# Altium schematic sheet FPGA.SchDoc
size A0; SheetNumber: 8; SheetTotal: 12
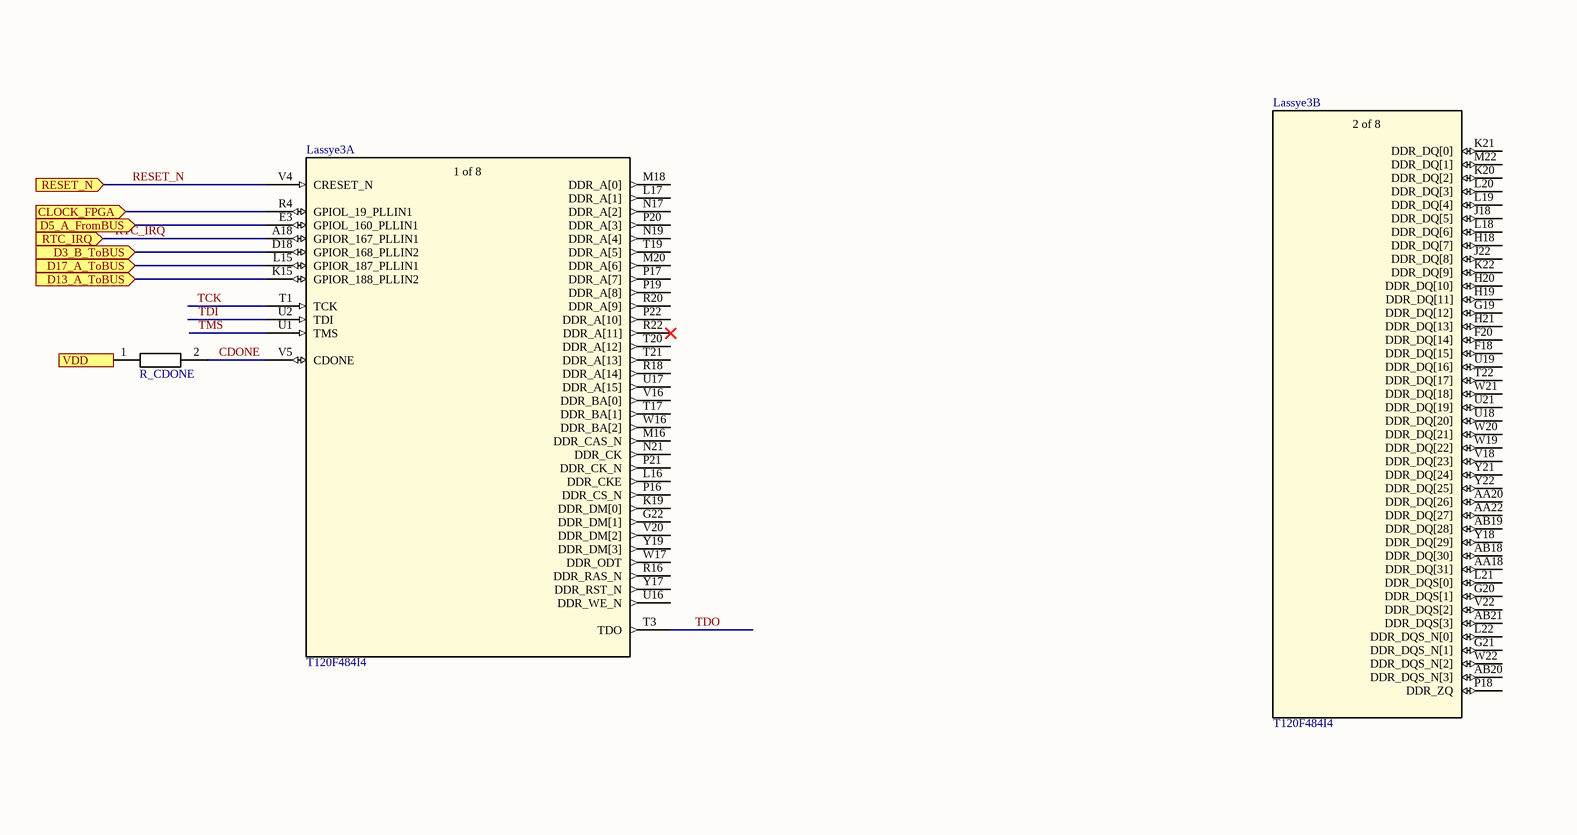
[diagram p0: FPGA.SchDoc, top left]
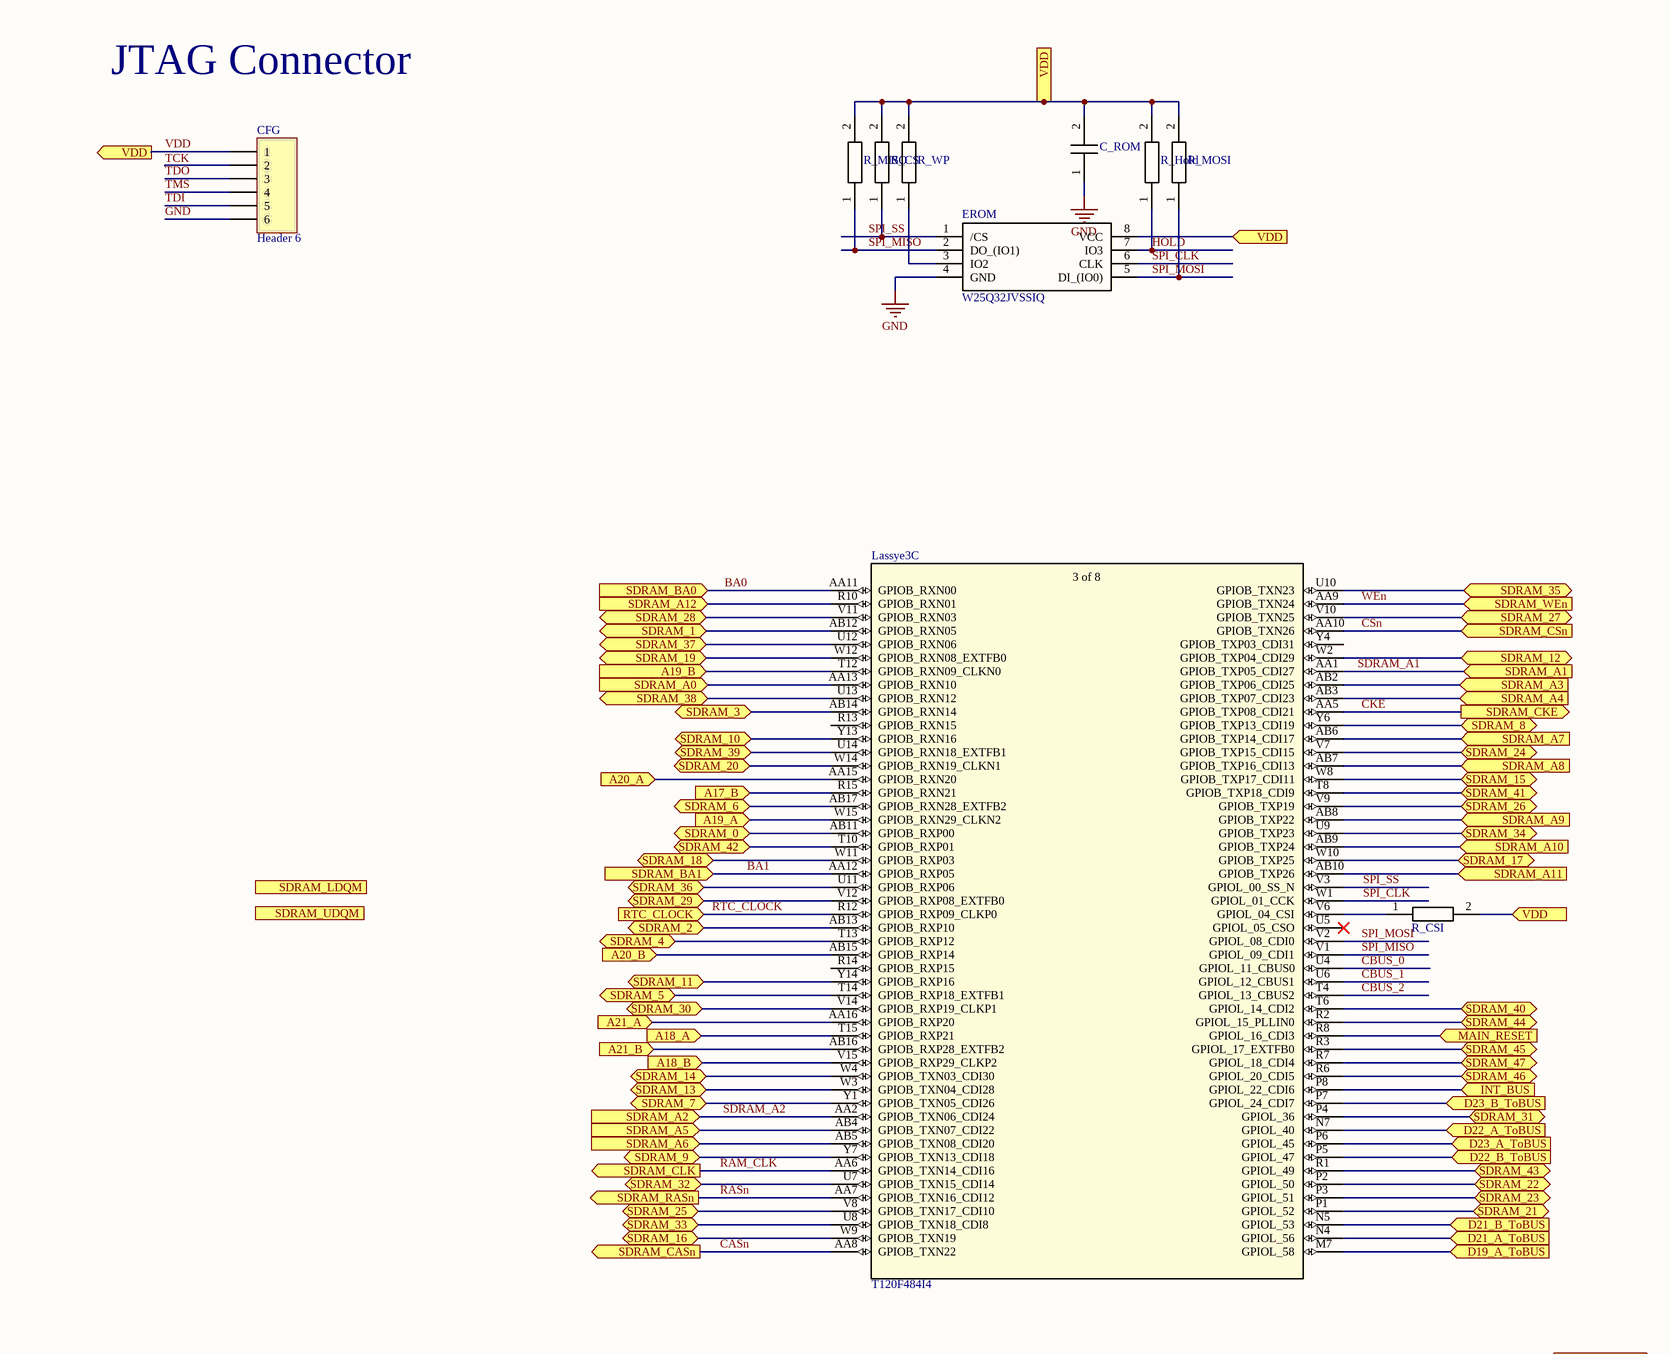
[diagram p1: FPGA.SchDoc, top middle]
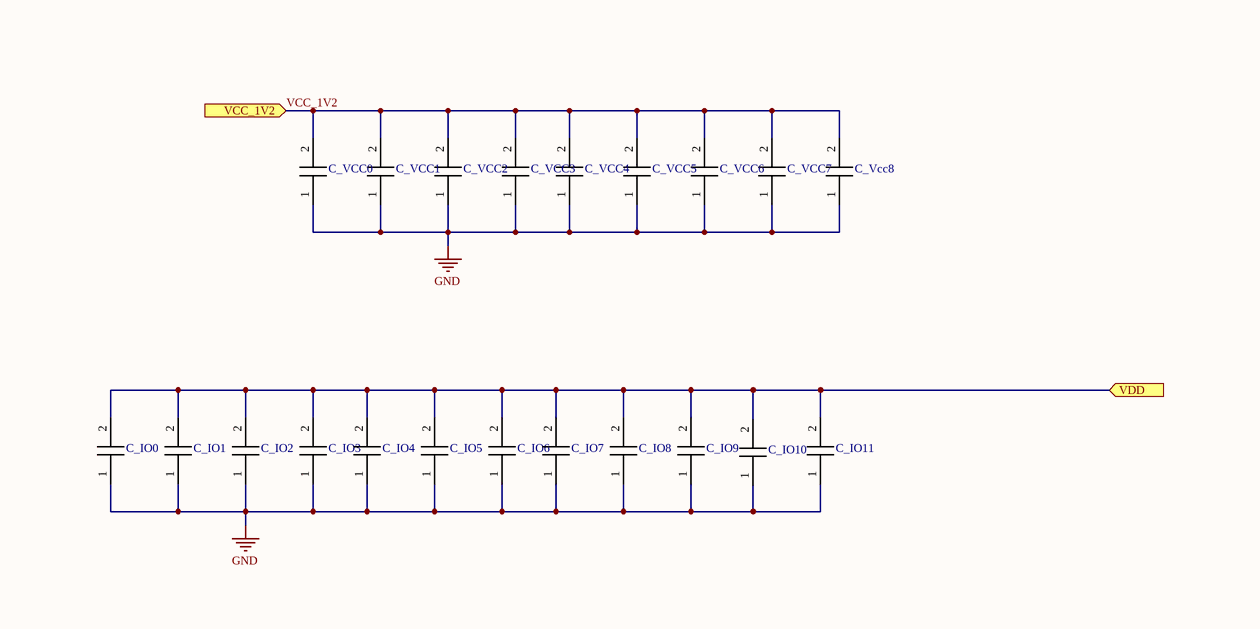
[diagram p2: FPGA.SchDoc, top right]
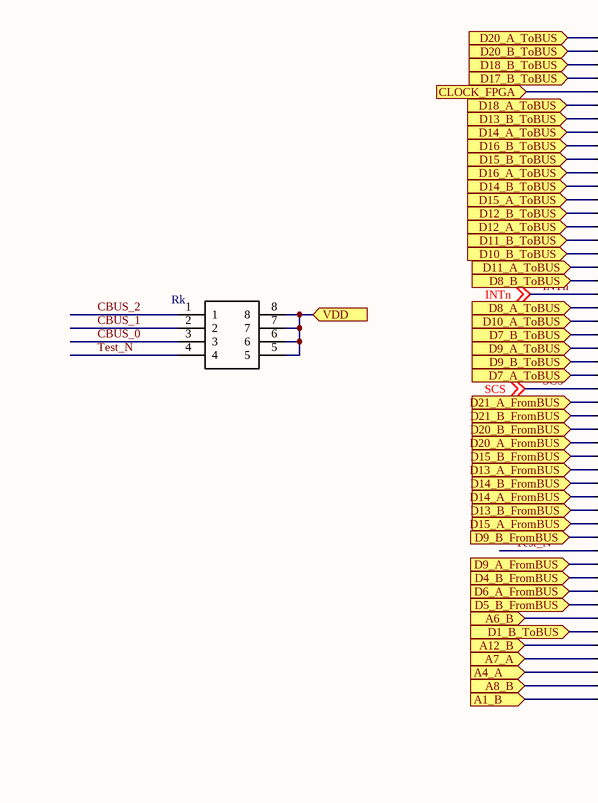
[diagram p3: FPGA.SchDoc, bottom middle]
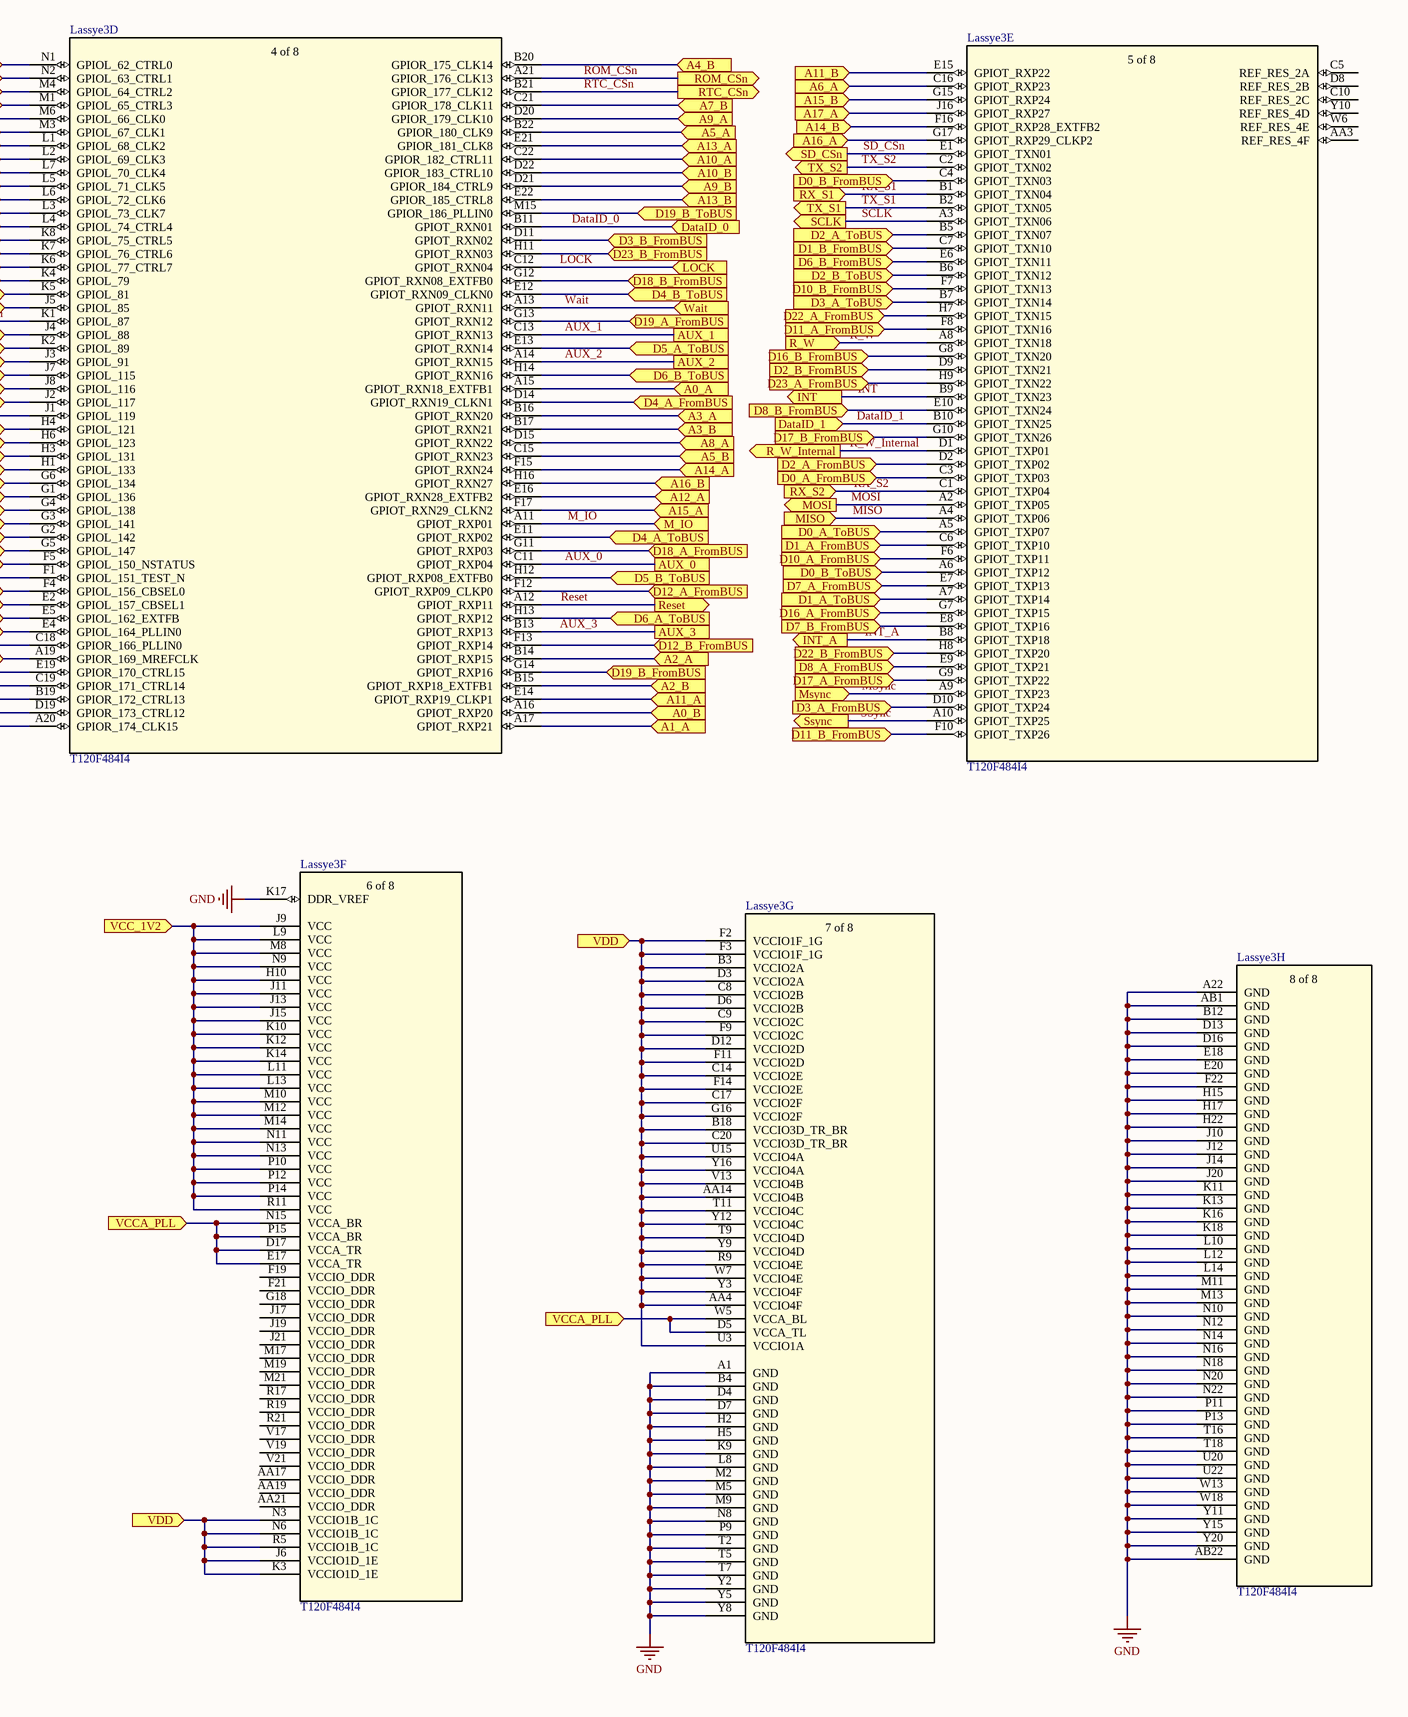
[diagram p4: FPGA.SchDoc, bottom right]

## Parts
C_IO0  GRM155R71C104JA88J  [CAPC1005X55N]  (value not drawn)
C_IO1  GRM155R71C104JA88J  [CAPC1005X55N]  (value not drawn)
C_IO2  GRM155R71C104JA88J  [CAPC1005X55N]  (value not drawn)
C_IO3  GRM155R71C104JA88J  [CAPC1005X55N]  (value not drawn)
C_IO4  GRM155R71C104JA88J  [CAPC1005X55N]  (value not drawn)
C_IO5  GRM155R71C104JA88J  [CAPC1005X55N]  (value not drawn)
C_IO6  GRM155R71C104JA88J  [CAPC1005X55N]  (value not drawn)
C_IO7  GRM155R71C104JA88J  [CAPC1005X55N]  (value not drawn)
C_IO8  GRM155R71C104JA88J  [CAPC1005X55N]  (value not drawn)
C_IO9  GRM155R71C104JA88J  [CAPC1005X55N]  (value not drawn)
C_IO10  GRM155R71C104JA88J  [CAPC1005X55N]  (value not drawn)
C_IO11  GRM155R71C104JA88J  [CAPC1005X55N]  (value not drawn)
C_ROM  0603YC104K4T2A  [CAPC1608X90N]  (value not drawn)
C_VCC0  GRM155R71C104JA88J  [CAPC1005X55N]  (value not drawn)
C_VCC1  GRM155R71C104JA88J  [CAPC1005X55N]  (value not drawn)
C_VCC2  GRM155R71C104JA88J  [CAPC1005X55N]  (value not drawn)
C_VCC3  GRM155R71C104JA88J  [CAPC1005X55N]  (value not drawn)
C_VCC4  GRM155R71C104JA88J  [CAPC1005X55N]  (value not drawn)
C_VCC5  GRM155R71C104JA88J  [CAPC1005X55N]  (value not drawn)
C_VCC6  GRM155R71C104JA88J  [CAPC1005X55N]  (value not drawn)
C_VCC7  GRM155R71C104JA88J  [CAPC1005X55N]  (value not drawn)
C_Vcc8  GRM155R71C104JA88J  [CAPC1005X55N]  (value not drawn)
CFG  Header 6  [HDR1X6]
EROM  W25Q32JVSSIQ  [SOIC127P790X216-8N]
Lassye3  T120F484I4  [FBGA484_TRION_EFI]  (parts A,B,C,D,E,F,G,H of 8)
R_CDONE  CRCW060310K0FKEB  [RESC1608X50N]  (value not drawn)
R_CS  CRCW060310K0FKEB  [RESC1608X50N]  (value not drawn)
R_CSI  CRCW060310K0FKEB  [RESC1608X50N]  (value not drawn)
R_Hold  CRCW060310K0FKEB  [RESC1608X50N]  (value not drawn)
R_MISO  CRCW060310K0FKEB  [RESC1608X50N]  (value not drawn)
R_MOSI  CRCW060310K0FKEB  [RESC1608X50N]  (value not drawn)
R_WP  CRCW060310K0FKEB  [RESC1608X50N]  (value not drawn)
Rk  CAT16A-1002F4LF  [CAT16A1002F4LF]  (value not drawn)

## Ports
A0_A (in), A0_B (in), A1_A (in), A1_B (in), A2_A (in), A2_B (in), A3_A (in), A3_B (in), A4_A (in), A4_B (in), A5_A (in), A5_B (in), A6_A (in), A6_B (in), A7_A (in), A7_B (in), A8_A (in), A8_B (in), A9_A (in), A9_B (in), A10_A (in), A10_B (in), A11_A (in), A11_B (in), A12_A (in), A12_B (in), A13_A (in), A13_B (in), A14_A (in), A14_B (in), A15_A (in), A15_B (in), A16_A (in), A16_B (in), A17_A (in), A17_B (in), A18_A (in), A18_B (in), A19_A (in), A19_B (in), A20_A (in), A20_B (in), A21_A (in), A21_B (in), AUX_0, AUX_1, AUX_2, AUX_3, CLOCK_FPGA (in), D0_A_FromBUS (in), D0_A_ToBUS (in), D0_B_FromBUS (in), D0_B_ToBUS (in), D1_A_FromBUS (in), D1_A_ToBUS (in), D1_B_FromBUS (in), D1_B_ToBUS (in), D2_A_FromBUS (in), D2_A_ToBUS (in), D2_B_FromBUS (in), D2_B_ToBUS (in), D3_A_FromBUS (in), D3_A_ToBUS (in), D3_B_FromBUS (in), D3_B_ToBUS (in), D4_A_FromBUS (in), D4_A_ToBUS (in), D4_B_FromBUS (in), D4_B_ToBUS (in), D5_A_FromBUS (in), D5_A_ToBUS (in), D5_B_FromBUS (in), D5_B_ToBUS (in), D6_A_FromBUS (in), D6_A_ToBUS (in), D6_B_FromBUS (in), D6_B_ToBUS (in), D7_A_FromBUS (in), D7_A_ToBUS (in), D7_B_FromBUS (in), D7_B_ToBUS (in), D8_A_FromBUS (in), D8_A_ToBUS (in), D8_B_FromBUS (in), D8_B_ToBUS (in), D9_A_FromBUS (in), D9_A_ToBUS (in), D9_B_FromBUS (in), D9_B_ToBUS (in), D10_A_FromBUS (in), D10_A_ToBUS (in), D10_B_FromBUS (in), D10_B_ToBUS (in), D11_A_FromBUS (in), D11_A_ToBUS (in), D11_B_FromBUS (in), D11_B_ToBUS (in), D12_A_FromBUS (in), D12_A_ToBUS (in), D12_B_FromBUS (in), D12_B_ToBUS (in), D13_A_FromBUS (in), D13_A_ToBUS (in), D13_B_FromBUS (in), D13_B_ToBUS (in), D14_A_FromBUS (in), D14_A_ToBUS (in), D14_B_FromBUS (in), D14_B_ToBUS (in), D15_A_FromBUS (in), D15_A_ToBUS (in), D15_B_FromBUS (in), D15_B_ToBUS (in), D16_A_FromBUS (in), D16_A_ToBUS (in), D16_B_FromBUS (in), D16_B_ToBUS (in), D17_A_FromBUS (in), D17_A_ToBUS (in), D17_B_FromBUS (in), D17_B_ToBUS (in), D18_A_FromBUS (in), D18_A_ToBUS (in), D18_B_FromBUS (in), D18_B_ToBUS (in), D19_A_FromBUS (in), D19_A_ToBUS (in), D19_B_FromBUS (in), D19_B_ToBUS (in), D20_A_FromBUS (in), D20_A_ToBUS (in), D20_B_FromBUS (in), D20_B_ToBUS (in), D21_A_FromBUS (in), D21_A_ToBUS (in), D21_B_FromBUS (in), D21_B_ToBUS (in), D22_A_FromBUS (in), D22_A_ToBUS (in), D22_B_FromBUS (in), D22_B_ToBUS (in), D23_A_FromBUS (in), D23_A_ToBUS (in), D23_B_FromBUS (in), D23_B_ToBUS (in), DataID_0 (in), DataID_1 (in), INT (out), INT_A (out), INT_BUS (in), LOCK (in), M_IO (in), MAIN_RESET (in), MISO (in), MOSI (out), Msync (in), R_W (in), R_W_Internal (out), Reset (out), RESET_N (in), ROM_CSn (out), RTC_CLOCK (in), RTC_CSn (out), RTC_IRQ (in), RX_S1 (in), RX_S2 (in), SCLK (out), SD_CSn (out), SDRAM_0 (bidir), SDRAM_1 (bidir), SDRAM_2 (bidir), SDRAM_3 (bidir), SDRAM_4 (bidir), SDRAM_5 (bidir), SDRAM_6 (bidir), SDRAM_7 (bidir), SDRAM_8 (bidir), SDRAM_9 (bidir), SDRAM_10 (bidir), SDRAM_11 (bidir), SDRAM_12 (bidir), SDRAM_13 (bidir), SDRAM_14 (bidir), SDRAM_15 (bidir), SDRAM_16 (bidir), SDRAM_17 (bidir), SDRAM_18 (bidir), SDRAM_19 (bidir), SDRAM_20 (bidir), SDRAM_21 (bidir), SDRAM_22 (bidir), SDRAM_23 (bidir), SDRAM_24 (bidir), SDRAM_25 (bidir), SDRAM_26 (bidir), SDRAM_27 (bidir), SDRAM_28 (bidir), SDRAM_29 (bidir), SDRAM_30 (bidir), SDRAM_31 (bidir), SDRAM_32 (bidir), SDRAM_33 (bidir), SDRAM_34 (bidir), SDRAM_35 (bidir), SDRAM_36 (bidir), SDRAM_37 (bidir), SDRAM_38 (bidir), SDRAM_39 (bidir), SDRAM_40 (bidir), SDRAM_41 (bidir), SDRAM_42 (bidir), SDRAM_43 (bidir), SDRAM_44 (bidir), SDRAM_45 (bidir), SDRAM_46 (bidir), SDRAM_47 (bidir), SDRAM_A0 (in), SDRAM_A1 (in), SDRAM_A2 (in), SDRAM_A3 (in), SDRAM_A4 (in), SDRAM_A5 (in), SDRAM_A6 (in), SDRAM_A7 (in), SDRAM_A8 (in), SDRAM_A9 (in), SDRAM_A10 (in), SDRAM_A11 (in), SDRAM_A12 (in), SDRAM_BA0 (in), SDRAM_BA1 (in), SDRAM_CASn (out), SDRAM_CKE (out), SDRAM_CLK (out), SDRAM_CSn (in), SDRAM_LDQM (out), SDRAM_RASn (out), SDRAM_UDQM (out), SDRAM_WEn (in), Ssync (out), TX_S1 (out), TX_S2 (out), VCC_1V2 (in), VCCA_PLL (in), VDD (in), VDD (out), Wait (in)

## Nets
GND: C_IO0.1 C_IO1.1 C_IO2.1 C_IO3.1 C_IO4.1 C_IO5.1 C_IO6.1 C_IO7.1 C_IO8.1 C_IO9.1 C_IO10.1 C_IO11.1 C_ROM.1 C_VCC0.1 C_VCC1.1 C_VCC2.1 C_VCC3.1 C_VCC4.1 C_VCC5.1 C_VCC6.1 C_VCC7.1 C_Vcc8.1 CFG.6 EROM.4(GND) Lassye3.A1(GND) Lassye3.A22(GND) Lassye3.AB1(GND) Lassye3.AB22(GND) Lassye3.B4(GND) Lassye3.B12(GND) Lassye3.D4(GND) Lassye3.D7(GND) Lassye3.D13(GND) Lassye3.D16(GND) Lassye3.E18(GND) Lassye3.E20(GND) Lassye3.F22(GND) Lassye3.H2(GND) Lassye3.H5(GND) Lassye3.H15(GND) Lassye3.H17(GND) Lassye3.H22(GND) Lassye3.J10(GND) Lassye3.J12(GND) Lassye3.J14(GND) Lassye3.J20(GND) Lassye3.K9(GND) Lassye3.K11(GND) Lassye3.K13(GND) Lassye3.K16(GND) Lassye3.K17(DDR_VREF) Lassye3.K18(GND) Lassye3.L8(GND) Lassye3.L10(GND) Lassye3.L12(GND) Lassye3.L14(GND) Lassye3.M2(GND) Lassye3.M5(GND) Lassye3.M9(GND) Lassye3.M11(GND) Lassye3.M13(GND) Lassye3.N8(GND) Lassye3.N10(GND) Lassye3.N12(GND) Lassye3.N14(GND) Lassye3.N16(GND) Lassye3.N18(GND) Lassye3.N20(GND) Lassye3.N22(GND) Lassye3.P9(GND) Lassye3.P11(GND) Lassye3.P13(GND) Lassye3.T2(GND) Lassye3.T5(GND) Lassye3.T7(GND) Lassye3.T16(GND) Lassye3.T18(GND) Lassye3.U20(GND) Lassye3.U22(GND) Lassye3.W13(GND) Lassye3.W18(GND) Lassye3.Y2(GND) Lassye3.Y5(GND) Lassye3.Y8(GND) Lassye3.Y11(GND) Lassye3.Y15(GND) Lassye3.Y20(GND)
A0_A: Lassye3.A15(GPIOT_RXN18_EXTFB1) ; port A0_A
A0_B: Lassye3.A16(GPIOT_RXP20) ; port A0_B
A1_A: Lassye3.A17(GPIOT_RXP21) ; port A1_A
A1_B: Lassye3.A20(GPIOR_174_CLK15) ; port A1_B
A2_A: Lassye3.B14(GPIOT_RXP15) ; port A2_A
A2_B: Lassye3.B15(GPIOT_RXP18_EXTFB1) ; port A2_B
A3_A: Lassye3.B16(GPIOT_RXN20) ; port A3_A
A3_B: Lassye3.B17(GPIOT_RXN21) ; port A3_B
A4_A: Lassye3.B19(GPIOR_172_CTRL13) ; port A4_A
A4_B: Lassye3.B20(GPIOR_175_CLK14) ; port A4_B
A5_A: Lassye3.B22(GPIOR_180_CLK9) ; port A5_A
A5_B: Lassye3.C15(GPIOT_RXN23) ; port A5_B
A6_A: Lassye3.C16(GPIOT_RXP23) ; port A6_A
A6_B: Lassye3.C18(GPIOR_166_PLLIN0) ; port A6_B
A7_A: Lassye3.C19(GPIOR_171_CTRL14) ; port A7_A
A7_B: Lassye3.C21(GPIOR_178_CLK11) ; port A7_B
A8_A: Lassye3.D15(GPIOT_RXN22) ; port A8_A
A8_B: Lassye3.D19(GPIOR_173_CTRL12) ; port A8_B
A9_A: Lassye3.D20(GPIOR_179_CLK10) ; port A9_A
A9_B: Lassye3.D21(GPIOR_184_CTRL9) ; port A9_B
A10_A: Lassye3.C22(GPIOR_182_CTRL11) ; port A10_A
A10_B: Lassye3.D22(GPIOR_183_CTRL10) ; port A10_B
A11_A: Lassye3.E14(GPIOT_RXP19_CLKP1) ; port A11_A
A11_B: Lassye3.E15(GPIOT_RXP22) ; port A11_B
A12_A: Lassye3.E16(GPIOT_RXN28_EXTFB2) ; port A12_A
A12_B: Lassye3.E19(GPIOR_170_CTRL15) ; port A12_B
A13_A: Lassye3.E21(GPIOR_181_CLK8) ; port A13_A
A13_B: Lassye3.E22(GPIOR_185_CTRL8) ; port A13_B
A14_A: Lassye3.F15(GPIOT_RXN24) ; port A14_A
A14_B: Lassye3.F16(GPIOT_RXP28_EXTFB2) ; port A14_B
A15_A: Lassye3.F17(GPIOT_RXN29_CLKN2) ; port A15_A
A15_B: Lassye3.G15(GPIOT_RXP24) ; port A15_B
A16_A: Lassye3.G17(GPIOT_RXP29_CLKP2) ; port A16_A
A16_B: Lassye3.H16(GPIOT_RXN27) ; port A16_B
A17_A: Lassye3.J16(GPIOT_RXP27) ; port A17_A
A17_B: Lassye3.R15(GPIOB_RXN21) ; port A17_B
A18_A: Lassye3.T15(GPIOB_RXP21) ; port A18_A
A18_B: Lassye3.V15(GPIOB_RXP29_CLKP2) ; port A18_B
A19_A: Lassye3.W15(GPIOB_RXN29_CLKN2) ; port A19_A
A19_B: Lassye3.T12(GPIOB_RXN09_CLKN0) ; port A19_B
A20_A: Lassye3.AA15(GPIOB_RXN20) ; port A20_A
A20_B: Lassye3.AB15(GPIOB_RXP14) ; port A20_B
A21_A: Lassye3.AA16(GPIOB_RXP20) ; port A21_A
A21_B: Lassye3.AB16(GPIOB_RXP28_EXTFB2) ; port A21_B
AUX_0: Lassye3.C11(GPIOT_RXP04) ; port AUX_0
AUX_1: Lassye3.C13(GPIOT_RXN13) ; port AUX_1
AUX_2: Lassye3.A14(GPIOT_RXN15) ; port AUX_2
AUX_3: Lassye3.B13(GPIOT_RXP13) ; port AUX_3
BA0: Lassye3.AA11(GPIOB_RXN00) ; port SDRAM_BA0
BA1: Lassye3.AA12(GPIOB_RXP05) ; port SDRAM_BA1
CASn: Lassye3.AA8(GPIOB_TXN22) ; port SDRAM_CASn
CBUS_0: Lassye3.U4(GPIOL_11_CBUS0) Rk.3
CBUS_1: Lassye3.U6(GPIOL_12_CBUS1) Rk.2
CBUS_2: Lassye3.T4(GPIOL_13_CBUS2) Rk.1
CDONE: Lassye3.V5(CDONE) R_CDONE.2
CKE: Lassye3.AA5(GPIOB_TXP08_CDI21) ; port SDRAM_CKE
CLOCK_FPGA: Lassye3.M6(GPIOL_66_CLK0) Lassye3.R4(GPIOL_19_PLLIN1) ; port CLOCK_FPGA
CSn: Lassye3.AA10(GPIOB_TXN26) ; port SDRAM_CSn
D0_A_FromBUS: Lassye3.C3(GPIOT_TXP03) ; port D0_A_FromBUS
D0_A_ToBUS: Lassye3.A5(GPIOT_TXP07) ; port D0_A_ToBUS
D0_B_FromBUS: Lassye3.C4(GPIOT_TXN03) ; port D0_B_FromBUS
D0_B_ToBUS: Lassye3.A6(GPIOT_TXP12) ; port D0_B_ToBUS
D1_A_FromBUS: Lassye3.C6(GPIOT_TXP10) ; port D1_A_FromBUS
D1_A_ToBUS: Lassye3.A7(GPIOT_TXP14) ; port D1_A_ToBUS
D1_B_FromBUS: Lassye3.C7(GPIOT_TXN10) ; port D1_B_FromBUS
D1_B_ToBUS: Lassye3.A19(GPIOR_169_MREFCLK) ; port D1_B_ToBUS
D2_A_FromBUS: Lassye3.D2(GPIOT_TXP02) ; port D2_A_FromBUS
D2_A_ToBUS: Lassye3.B5(GPIOT_TXN07) ; port D2_A_ToBUS
D2_B_FromBUS: Lassye3.D9(GPIOT_TXN21) ; port D2_B_FromBUS
D2_B_ToBUS: Lassye3.B6(GPIOT_TXN12) ; port D2_B_ToBUS
D3_A_FromBUS: Lassye3.D10(GPIOT_TXP24) ; port D3_A_FromBUS
D3_A_ToBUS: Lassye3.B7(GPIOT_TXN14) ; port D3_A_ToBUS
D3_B_FromBUS: Lassye3.D11(GPIOT_RXN02) ; port D3_B_FromBUS
D3_B_ToBUS: Lassye3.D18(GPIOR_168_PLLIN2) ; port D3_B_ToBUS
D4_A_FromBUS: Lassye3.D14(GPIOT_RXN19_CLKN1) ; port D4_A_FromBUS
D4_A_ToBUS: Lassye3.E11(GPIOT_RXP02) ; port D4_A_ToBUS
D4_B_FromBUS: Lassye3.E2(GPIOL_157_CBSEL1) ; port D4_B_FromBUS
D4_B_ToBUS: Lassye3.E12(GPIOT_RXN09_CLKN0) ; port D4_B_ToBUS
D5_A_FromBUS: Lassye3.E3(GPIOL_160_PLLIN1) ; port D5_A_FromBUS
D5_A_ToBUS: Lassye3.E13(GPIOT_RXN14) ; port D5_A_ToBUS
D5_B_FromBUS: Lassye3.E4(GPIOL_164_PLLIN0) ; port D5_B_FromBUS
D5_B_ToBUS: Lassye3.H12(GPIOT_RXP08_EXTFB0) ; port D5_B_ToBUS
D6_A_FromBUS: Lassye3.E5(GPIOL_162_EXTFB) ; port D6_A_FromBUS
D6_A_ToBUS: Lassye3.H13(GPIOT_RXP12) ; port D6_A_ToBUS
D6_B_FromBUS: Lassye3.E6(GPIOT_TXN11) ; port D6_B_FromBUS
D6_B_ToBUS: Lassye3.H14(GPIOT_RXN16) ; port D6_B_ToBUS
D7_A_FromBUS: Lassye3.E7(GPIOT_TXP13) ; port D7_A_FromBUS
D7_A_ToBUS: Lassye3.J2(GPIOL_117) ; port D7_A_ToBUS
D7_B_FromBUS: Lassye3.E8(GPIOT_TXP16) ; port D7_B_FromBUS
D7_B_ToBUS: Lassye3.J3(GPIOL_91) ; port D7_B_ToBUS
D8_A_FromBUS: Lassye3.E9(GPIOT_TXP21) ; port D8_A_FromBUS
D8_A_ToBUS: Lassye3.J4(GPIOL_88) ; port D8_A_ToBUS
D8_B_FromBUS: Lassye3.E10(GPIOT_TXN24) ; port D8_B_FromBUS
D8_B_ToBUS: Lassye3.J5(GPIOL_85) ; port D8_B_ToBUS
D9_A_FromBUS: Lassye3.F4(GPIOL_156_CBSEL0) ; port D9_A_FromBUS
D9_A_ToBUS: Lassye3.J7(GPIOL_115) ; port D9_A_ToBUS
D9_B_FromBUS: Lassye3.F5(GPIOL_150_NSTATUS) ; port D9_B_FromBUS
D9_B_ToBUS: Lassye3.J8(GPIOL_116) ; port D9_B_ToBUS
D10_A_FromBUS: Lassye3.F6(GPIOT_TXP11) ; port D10_A_FromBUS
D10_A_ToBUS: Lassye3.K2(GPIOL_89) ; port D10_A_ToBUS
D10_B_FromBUS: Lassye3.F7(GPIOT_TXN13) ; port D10_B_FromBUS
D10_B_ToBUS: Lassye3.K4(GPIOL_79) ; port D10_B_ToBUS
D11_A_FromBUS: Lassye3.F8(GPIOT_TXN16) ; port D11_A_FromBUS
D11_A_ToBUS: Lassye3.K5(GPIOL_81) ; port D11_A_ToBUS
D11_B_FromBUS: Lassye3.F10(GPIOT_TXP26) ; port D11_B_FromBUS
D11_B_ToBUS: Lassye3.K6(GPIOL_77_CTRL7) ; port D11_B_ToBUS
D12_A_FromBUS: Lassye3.F12(GPIOT_RXP09_CLKP0) ; port D12_A_FromBUS
D12_A_ToBUS: Lassye3.K7(GPIOL_76_CTRL6) ; port D12_A_ToBUS
D12_B_FromBUS: Lassye3.F13(GPIOT_RXP14) ; port D12_B_FromBUS
D12_B_ToBUS: Lassye3.K8(GPIOL_75_CTRL5) ; port D12_B_ToBUS
D13_A_FromBUS: Lassye3.G1(GPIOL_136) ; port D13_A_FromBUS
D13_A_ToBUS: Lassye3.K15(GPIOR_188_PLLIN2) ; port D13_A_ToBUS
D13_B_FromBUS: Lassye3.G2(GPIOL_142) ; port D13_B_FromBUS
D13_B_ToBUS: Lassye3.L1(GPIOL_68_CLK2) ; port D13_B_ToBUS
D14_A_FromBUS: Lassye3.G3(GPIOL_141) ; port D14_A_FromBUS
D14_A_ToBUS: Lassye3.L2(GPIOL_69_CLK3) ; port D14_A_ToBUS
D14_B_FromBUS: Lassye3.G4(GPIOL_138) ; port D14_B_FromBUS
D14_B_ToBUS: Lassye3.L3(GPIOL_73_CLK7) ; port D14_B_ToBUS
D15_A_FromBUS: Lassye3.G5(GPIOL_147) ; port D15_A_FromBUS
D15_A_ToBUS: Lassye3.L4(GPIOL_74_CTRL4) ; port D15_A_ToBUS
D15_B_FromBUS: Lassye3.G6(GPIOL_134) ; port D15_B_FromBUS
D15_B_ToBUS: Lassye3.L5(GPIOL_71_CLK5) ; port D15_B_ToBUS
D16_A_FromBUS: Lassye3.G7(GPIOT_TXP15) ; port D16_A_FromBUS
D16_A_ToBUS: Lassye3.L6(GPIOL_72_CLK6) ; port D16_A_ToBUS
D16_B_FromBUS: Lassye3.G8(GPIOT_TXN20) ; port D16_B_FromBUS
D16_B_ToBUS: Lassye3.L7(GPIOL_70_CLK4) ; port D16_B_ToBUS
D17_A_FromBUS: Lassye3.G9(GPIOT_TXP22) ; port D17_A_FromBUS
D17_A_ToBUS: Lassye3.L15(GPIOR_187_PLLIN1) ; port D17_A_ToBUS
D17_B_FromBUS: Lassye3.G10(GPIOT_TXN26) ; port D17_B_FromBUS
D17_B_ToBUS: Lassye3.M1(GPIOL_65_CTRL3) ; port D17_B_ToBUS
D18_A_FromBUS: Lassye3.G11(GPIOT_RXP03) ; port D18_A_FromBUS
D18_A_ToBUS: Lassye3.M3(GPIOL_67_CLK1) ; port D18_A_ToBUS
D18_B_FromBUS: Lassye3.G12(GPIOT_RXN08_EXTFB0) ; port D18_B_FromBUS
D18_B_ToBUS: Lassye3.M4(GPIOL_64_CTRL2) ; port D18_B_ToBUS
D19_A_FromBUS: Lassye3.G13(GPIOT_RXN12) ; port D19_A_FromBUS
D19_A_ToBUS: Lassye3.M7(GPIOL_58) ; port D19_A_ToBUS
D19_B_FromBUS: Lassye3.G14(GPIOT_RXP16) ; port D19_B_FromBUS
D19_B_ToBUS: Lassye3.M15(GPIOR_186_PLLIN0) ; port D19_B_ToBUS
D20_A_FromBUS: Lassye3.H1(GPIOL_133) ; port D20_A_FromBUS
D20_A_ToBUS: Lassye3.N1(GPIOL_62_CTRL0) ; port D20_A_ToBUS
D20_B_FromBUS: Lassye3.H3(GPIOL_131) ; port D20_B_FromBUS
D20_B_ToBUS: Lassye3.N2(GPIOL_63_CTRL1) ; port D20_B_ToBUS
D21_A_FromBUS: Lassye3.H4(GPIOL_121) ; port D21_A_FromBUS
D21_A_ToBUS: Lassye3.N4(GPIOL_56) ; port D21_A_ToBUS
D21_B_FromBUS: Lassye3.H6(GPIOL_123) ; port D21_B_FromBUS
D21_B_ToBUS: Lassye3.N5(GPIOL_53) ; port D21_B_ToBUS
D22_A_FromBUS: Lassye3.H7(GPIOT_TXN15) ; port D22_A_FromBUS
D22_A_ToBUS: Lassye3.N7(GPIOL_40) ; port D22_A_ToBUS
D22_B_FromBUS: Lassye3.H8(GPIOT_TXP20) ; port D22_B_FromBUS
D22_B_ToBUS: Lassye3.P5(GPIOL_47) ; port D22_B_ToBUS
D23_A_FromBUS: Lassye3.H9(GPIOT_TXN22) ; port D23_A_FromBUS
D23_A_ToBUS: Lassye3.P6(GPIOL_45) ; port D23_A_ToBUS
D23_B_FromBUS: Lassye3.H11(GPIOT_RXN03) ; port D23_B_FromBUS
D23_B_ToBUS: Lassye3.P7(GPIOL_24_CDI7) ; port D23_B_ToBUS
DataID_0: Lassye3.B11(GPIOT_RXN01) ; port DataID_0
DataID_1: Lassye3.B10(GPIOT_TXN25) ; port DataID_1
HOLD: EROM.7(IO3) R_Hold.1
INT: Lassye3.B9(GPIOT_TXN23) ; port INT
INT_A: Lassye3.B8(GPIOT_TXP18) ; port INT_A
INT_BUS: Lassye3.P8(GPIOL_22_CDI6) ; port INT_BUS
INTn: Lassye3.K1(GPIOL_87) ; off-sheet INTn
LOCK: Lassye3.C12(GPIOT_RXN04) ; port LOCK
M_IO: Lassye3.A11(GPIOT_RXP01) ; port M_IO
MAIN_RESET: Lassye3.R8(GPIOL_16_CDI3) ; port MAIN_RESET
MISO: Lassye3.A4(GPIOT_TXP06) ; port MISO
MOSI: Lassye3.A2(GPIOT_TXP05) ; port MOSI
MSync: Lassye3.A9(GPIOT_TXP23) ; port Msync
R_W: Lassye3.A8(GPIOT_TXN18) ; port R_W
R_W_Internal: Lassye3.D1(GPIOT_TXP01) ; port R_W_Internal
RAM_CLK: Lassye3.AA6(GPIOB_TXN14_CDI16) ; port SDRAM_CLK
RASn: Lassye3.AA7(GPIOB_TXN16_CDI12) ; port SDRAM_RASn
Reset: Lassye3.A12(GPIOT_RXP11) ; port Reset
RESET_N: Lassye3.V4(CRESET_N) ; port RESET_N
ROM_CSn: Lassye3.A21(GPIOR_176_CLK13) ; port ROM_CSn
RTC_CLOCK: Lassye3.R12(GPIOB_RXP09_CLKP0) ; port RTC_CLOCK
RTC_CSn: Lassye3.B21(GPIOR_177_CLK12) ; port RTC_CSn
RTC_IRQ: Lassye3.A18(GPIOR_167_PLLIN1) ; port RTC_IRQ
RX_S1: Lassye3.B1(GPIOT_TXN04) ; port RX_S1
RX_S2: Lassye3.C1(GPIOT_TXP04) ; port RX_S2
SCLK: Lassye3.A3(GPIOT_TXN06) ; port SCLK
SCS: Lassye3.J1(GPIOL_119) ; off-sheet SCS
SD_CSn: Lassye3.E1(GPIOT_TXN01) ; port SD_CSn
SDRAM_0: Lassye3.AB11(GPIOB_RXP00) ; port SDRAM_0
SDRAM_1: Lassye3.AB12(GPIOB_RXN05) ; port SDRAM_1
SDRAM_2: Lassye3.AB13(GPIOB_RXP10) ; port SDRAM_2
SDRAM_3: Lassye3.AB14(GPIOB_RXN14) ; port SDRAM_3
SDRAM_4: Lassye3.T13(GPIOB_RXP12) ; port SDRAM_4
SDRAM_5: Lassye3.T14(GPIOB_RXP18_EXTFB1) ; port SDRAM_5
SDRAM_6: Lassye3.AB17(GPIOB_RXN28_EXTFB2) ; port SDRAM_6
SDRAM_7: Lassye3.Y1(GPIOB_TXN05_CDI26) ; port SDRAM_7
SDRAM_8: Lassye3.Y6(GPIOB_TXP13_CDI19) ; port SDRAM_8
SDRAM_9: Lassye3.Y7(GPIOB_TXN13_CDI18) ; port SDRAM_9
SDRAM_10: Lassye3.Y13(GPIOB_RXN16) ; port SDRAM_10
SDRAM_11: Lassye3.Y14(GPIOB_RXP16) ; port SDRAM_11
SDRAM_12: Lassye3.W2(GPIOB_TXP04_CDI29) ; port SDRAM_12
SDRAM_13: Lassye3.W3(GPIOB_TXN04_CDI28) ; port SDRAM_13
SDRAM_14: Lassye3.W4(GPIOB_TXN03_CDI30) ; port SDRAM_14
SDRAM_15: Lassye3.W8(GPIOB_TXP17_CDI11) ; port SDRAM_15
SDRAM_16: Lassye3.W9(GPIOB_TXN19) ; port SDRAM_16
SDRAM_17: Lassye3.W10(GPIOB_TXP25) ; port SDRAM_17
SDRAM_18: Lassye3.W11(GPIOB_RXP03) ; port SDRAM_18
SDRAM_19: Lassye3.W12(GPIOB_RXN08_EXTFB0) ; port SDRAM_19
SDRAM_20: Lassye3.W14(GPIOB_RXN19_CLKN1) ; port SDRAM_20
SDRAM_21: Lassye3.P1(GPIOL_52) ; port SDRAM_21
SDRAM_22: Lassye3.P2(GPIOL_50) ; port SDRAM_22
SDRAM_23: Lassye3.P3(GPIOL_51) ; port SDRAM_23
SDRAM_24: Lassye3.V7(GPIOB_TXP15_CDI15) ; port SDRAM_24
SDRAM_25: Lassye3.V8(GPIOB_TXN17_CDI10) ; port SDRAM_25
SDRAM_26: Lassye3.V9(GPIOB_TXP19) ; port SDRAM_26
SDRAM_27: Lassye3.V10(GPIOB_TXN25) ; port SDRAM_27
SDRAM_28: Lassye3.V11(GPIOB_RXN03) ; port SDRAM_28
SDRAM_29: Lassye3.V12(GPIOB_RXP08_EXTFB0) ; port SDRAM_29
SDRAM_30: Lassye3.V14(GPIOB_RXP19_CLKP1) ; port SDRAM_30
SDRAM_31: Lassye3.P4(GPIOL_36) ; port SDRAM_31
SDRAM_32: Lassye3.U7(GPIOB_TXN15_CDI14) ; port SDRAM_32
SDRAM_33: Lassye3.U8(GPIOB_TXN18_CDI8) ; port SDRAM_33
SDRAM_34: Lassye3.U9(GPIOB_TXP23) ; port SDRAM_34
SDRAM_35: Lassye3.U10(GPIOB_TXN23) ; port SDRAM_35
SDRAM_36: Lassye3.U11(GPIOB_RXP06) ; port SDRAM_36
SDRAM_37: Lassye3.U12(GPIOB_RXN06) ; port SDRAM_37
SDRAM_38: Lassye3.U13(GPIOB_RXN12) ; port SDRAM_38
SDRAM_39: Lassye3.U14(GPIOB_RXN18_EXTFB1) ; port SDRAM_39
SDRAM_40: Lassye3.T6(GPIOL_14_CDI2) ; port SDRAM_40
SDRAM_41: Lassye3.T8(GPIOB_TXP18_CDI9) ; port SDRAM_41
SDRAM_42: Lassye3.T10(GPIOB_RXP01) ; port SDRAM_42
SDRAM_43: Lassye3.R1(GPIOL_49) ; port SDRAM_43
SDRAM_44: Lassye3.R2(GPIOL_15_PLLIN0) ; port SDRAM_44
SDRAM_45: Lassye3.R3(GPIOL_17_EXTFB0) ; port SDRAM_45
SDRAM_46: Lassye3.R6(GPIOL_20_CDI5) ; port SDRAM_46
SDRAM_47: Lassye3.R7(GPIOL_18_CDI4) ; port SDRAM_47
SDRAM_A0: Lassye3.AA13(GPIOB_RXN10) ; port SDRAM_A0
SDRAM_A1: Lassye3.AA1(GPIOB_TXP05_CDI27) ; port SDRAM_A1
SDRAM_A2: Lassye3.AA2(GPIOB_TXN06_CDI24) ; port SDRAM_A2
SDRAM_A3: Lassye3.AB2(GPIOB_TXP06_CDI25) ; port SDRAM_A3
SDRAM_A4: Lassye3.AB3(GPIOB_TXP07_CDI23) ; port SDRAM_A4
SDRAM_A5: Lassye3.AB4(GPIOB_TXN07_CDI22) ; port SDRAM_A5
SDRAM_A6: Lassye3.AB5(GPIOB_TXN08_CDI20) ; port SDRAM_A6
SDRAM_A7: Lassye3.AB6(GPIOB_TXP14_CDI17) ; port SDRAM_A7
SDRAM_A8: Lassye3.AB7(GPIOB_TXP16_CDI13) ; port SDRAM_A8
SDRAM_A9: Lassye3.AB8(GPIOB_TXP22) ; port SDRAM_A9
SDRAM_A10: Lassye3.AB9(GPIOB_TXP24) ; port SDRAM_A10
SDRAM_A11: Lassye3.AB10(GPIOB_TXP26) ; port SDRAM_A11
SDRAM_A12: Lassye3.R10(GPIOB_RXN01) ; port SDRAM_A12
SPI_CLK: EROM.6(CLK) Lassye3.W1(GPIOL_01_CCK)
SPI_MISO: EROM.2(DO_(IO1)) Lassye3.V1(GPIOL_09_CDI1) R_MISO.1
SPI_MOSI: EROM.5(DI_(IO0)) Lassye3.V2(GPIOL_08_CDI0) R_MOSI.1
SPI_SS: EROM.1(/CS) Lassye3.V3(GPIOL_00_SS_N) R_CS.1
SSync: Lassye3.A10(GPIOT_TXP25) ; port Ssync
TCK: CFG.2 Lassye3.T1(TCK)
TDI: CFG.5 Lassye3.U2(TDI)
TDO: CFG.3 Lassye3.T3(TDO)
Test_N: Lassye3.F1(GPIOL_151_TEST_N) Rk.4
TMS: CFG.4 Lassye3.U1(TMS)
TX_S1: Lassye3.B2(GPIOT_TXN05) ; port TX_S1
TX_S2: Lassye3.C2(GPIOT_TXN02) ; port TX_S2
VCC_1V2: C_VCC0.2 C_VCC1.2 C_VCC2.2 C_VCC3.2 C_VCC4.2 C_VCC5.2 C_VCC6.2 C_VCC7.2 C_Vcc8.2 Lassye3.H10(VCC) Lassye3.J9(VCC) Lassye3.J11(VCC) Lassye3.J13(VCC) Lassye3.J15(VCC) Lassye3.K10(VCC) Lassye3.K12(VCC) Lassye3.K14(VCC) Lassye3.L9(VCC) Lassye3.L11(VCC) Lassye3.L13(VCC) Lassye3.M8(VCC) Lassye3.M10(VCC) Lassye3.M12(VCC) Lassye3.M14(VCC) Lassye3.N9(VCC) Lassye3.N11(VCC) Lassye3.N13(VCC) Lassye3.P10(VCC) Lassye3.P12(VCC) Lassye3.P14(VCC) Lassye3.R11(VCC) ; port VCC_1V2
VCCA_PLL: Lassye3.D5(VCCA_TL) Lassye3.D17(VCCA_TR) Lassye3.E17(VCCA_TR) Lassye3.N15(VCCA_BR) Lassye3.P15(VCCA_BR) Lassye3.W5(VCCA_BL) ; port VCCA_PLL
VDD: C_IO0.2 C_IO1.2 C_IO2.2 C_IO3.2 C_IO4.2 C_IO5.2 C_IO6.2 C_IO7.2 C_IO8.2 C_IO9.2 C_IO10.2 C_IO11.2 C_ROM.2 CFG.1 EROM.8(VCC) Lassye3.AA4(VCCIO4F) Lassye3.AA14(VCCIO4B) Lassye3.B3(VCCIO2A) Lassye3.B18(VCCIO3D_TR_BR) Lassye3.C8(VCCIO2B) Lassye3.C9(VCCIO2C) Lassye3.C14(VCCIO2E) Lassye3.C17(VCCIO2F) Lassye3.C20(VCCIO3D_TR_BR) Lassye3.D3(VCCIO2A) Lassye3.D6(VCCIO2B) Lassye3.D12(VCCIO2D) Lassye3.F2(VCCIO1F_1G) Lassye3.F3(VCCIO1F_1G) Lassye3.F9(VCCIO2C) Lassye3.F11(VCCIO2D) Lassye3.F14(VCCIO2E) Lassye3.G16(VCCIO2F) Lassye3.J6(VCCIO1D_1E) Lassye3.K3(VCCIO1D_1E) Lassye3.N3(VCCIO1B_1C) Lassye3.N6(VCCIO1B_1C) Lassye3.R5(VCCIO1B_1C) Lassye3.R9(VCCIO4E) Lassye3.T9(VCCIO4D) Lassye3.T11(VCCIO4C) Lassye3.U3(VCCIO1A) Lassye3.U15(VCCIO4A) Lassye3.V13(VCCIO4B) Lassye3.W7(VCCIO4E) Lassye3.Y3(VCCIO4F) Lassye3.Y9(VCCIO4D) Lassye3.Y12(VCCIO4C) Lassye3.Y16(VCCIO4A) R_CDONE.1 R_CS.2 R_CSI.2 R_Hold.2 R_MISO.2 R_MOSI.2 R_WP.2 Rk.5 Rk.6 Rk.7 Rk.8 ; port VDD
Wait: Lassye3.A13(GPIOT_RXN11) ; port Wait
WEn: Lassye3.AA9(GPIOB_TXN24) ; port SDRAM_WEn
NetEROM_3: EROM.3(IO2) R_WP.1
NetLassye3_V6: Lassye3.V6(GPIOL_04_CSI) R_CSI.1

Not connected (* = marked no-connect by the designer): Lassye3 AA3(REF_RES_4F) AA17(VCCIO_DDR) AA18(DDR_DQ[31]) AA19(VCCIO_DDR) AA20(DDR_DQ[26]) AA21(VCCIO_DDR) AA22(DDR_DQ[27]) AB18(DDR_DQ[30]) AB19(DDR_DQ[28]) AB20(DDR_DQS_N[3]) AB21(DDR_DQS[3]) C5(REF_RES_2A) C10(REF_RES_2C) D8(REF_RES_2B) F18(DDR_DQ[15]) F19(VCCIO_DDR) F20(DDR_DQ[14]) F21(VCCIO_DDR) G18(VCCIO_DDR) G19(DDR_DQ[12]) G20(DDR_DQS[1]) G21(DDR_DQS_N[1]) G22(DDR_DM[1]) H18(DDR_DQ[7]) H19(DDR_DQ[11]) H20(DDR_DQ[10]) H21(DDR_DQ[13]) J17(VCCIO_DDR) J18(DDR_DQ[5]) J19(VCCIO_DDR) J21(VCCIO_DDR) J22(DDR_DQ[8]) K19(DDR_DM[0]) K20(DDR_DQ[2]) K21(DDR_DQ[0]) K22(DDR_DQ[9]) L16(DDR_CKE) L17(DDR_A[1]) L18(DDR_DQ[6]) L19(DDR_DQ[4]) L20(DDR_DQ[3]) L21(DDR_DQS[0]) L22(DDR_DQS_N[0]) M16(DDR_CAS_N) M17(VCCIO_DDR) M18(DDR_A[0]) M19(VCCIO_DDR) M20(DDR_A[6]) M21(VCCIO_DDR) M22(DDR_DQ[1]) N17(DDR_A[2]) N19(DDR_A[4]) N21(DDR_CK) P16(DDR_CS_N) P17(DDR_A[7]) P18(DDR_ZQ) P19(DDR_A[8]) P20(DDR_A[3]) P21(DDR_CK_N) P22(DDR_A[10]) R13(GPIOB_RXN15) R14(GPIOB_RXP15) R16(DDR_RAS_N) R17(VCCIO_DDR) R18(DDR_A[14]) R19(VCCIO_DDR) R20(DDR_A[9]) R21(VCCIO_DDR) R22(DDR_A[11])* T17(DDR_BA[1]) T19(DDR_A[5]) T20(DDR_A[12]) T21(DDR_A[13]) T22(DDR_DQ[17]) U5(GPIOL_05_CSO)* U16(DDR_WE_N) U17(DDR_A[15]) U18(DDR_DQ[20]) U19(DDR_DQ[16]) U21(DDR_DQ[19]) V16(DDR_BA[0]) V17(VCCIO_DDR) V18(DDR_DQ[23]) V19(VCCIO_DDR) V20(DDR_DM[2]) V21(VCCIO_DDR) V22(DDR_DQS[2]) W6(REF_RES_4E) W16(DDR_BA[2]) W17(DDR_ODT) W19(DDR_DQ[22]) W20(DDR_DQ[21]) W21(DDR_DQ[18]) W22(DDR_DQS_N[2]) Y4(GPIOB_TXP03_CDI31) Y10(REF_RES_4D) Y17(DDR_RST_N) Y18(DDR_DQ[29]) Y19(DDR_DM[3]) Y21(DDR_DQ[24]) Y22(DDR_DQ[25])

## Notes on the sheet
- JTAG Connector
- (in symbol T120F484I4, part A) 1 of 8
- (in symbol T120F484I4, part B) 2 of 8
- (in symbol T120F484I4, part C) 3 of 8
- (in symbol T120F484I4, part D) 4 of 8
- (in symbol T120F484I4, part E) 5 of 8
- (in symbol T120F484I4, part F) 6 of 8
- (in symbol T120F484I4, part G) 7 of 8
- (in symbol T120F484I4, part H) 8 of 8

## Library data of the parts
C_IO0-C_IO11 C_VCC0-C_VCC7 C_Vcc8 = GRM155R71C104JA88J: Capacitor; Manufacturer_Name: Murata Electronics; Datasheet Link: https://datasheet.datasheetarchive.com/originals/distributors/DKDS-10/191304.pdf; Height: 0.55mm; Manufacturer_Part_Number: GRM155R71C104JA88J; Mouser Part Number: 81-GRM155R71C104JA8J; Mouser Price/Stock: https://www.mouser.co.uk/ProductDetail/Murata-Electronics/GRM155R71C104JA88J?qs=hNud%2FORuBR1FShEh%252B0yzMw%3D%3D; Arrow Part Number: GRM155R71C104JA88J; Arrow Price/Stock: https://www.arrow.com/en/products/grm155r71c104ja88j/murata-manufacturing?region=nac
C_ROM = 0603YC104K4T2A: Capacitor; Manufacturer_Name: AVX; Datasheet Link: http://www.mouser.com/catalog/supplier/library/pdf/AVXSurfaceMountCeramic.pdf; Height: 0.9mm; Manufacturer_Part_Number: 0603YC104K4T2A; Mouser Part Number: 581-0603YC104K4; Mouser Price/Stock: https://www.mouser.co.uk/ProductDetail/AVX/0603YC104K4T2A/?qs=Cej1j9ztgjHj4I01NaBI3A%3D%3D; Arrow Part Number: 0603YC104K4T2A; Arrow Price/Stock: https://www.arrow.com/en/products/0603yc104k4t2a/avx
CFG = Header 6: Header, 6-Pin; LatestRevisionDate: 17-Jul-2002; LatestRevisionNote: Re-released for DXP Platform.; Publisher: Altium Limited
EROM = W25Q32JVSSIQ: Integrated Circuit; Manufacturer_Name: Winbond; Datasheet Link: https://www.winbond.com/hq/search-resource-file.jsp?partNo=W25Q32JVSSIQ&type=datasheet; Height: 2.16mm; Manufacturer_Part_Number: W25Q32JVSSIQ; Mouser Part Number: 454-W25Q32JVSSIQ; Mouser Price/Stock: https://www.mouser.co.uk/ProductDetail/Winbond/W25Q32JVSSIQ?qs=qSfuJ%252Bfl%2Fd4PGZSN0WxfCA%3D%3D; Arrow Part Number: W25Q32JVSSIQ; Arrow Price/Stock: https://www.arrow.com/en/products/w25q32jvssiq/winbond-electronics?region=nac
Lassye3 = T120F484I4: No Description Available; Mfr_Name: Efinix; RefDes: RefDes; Type: Type
R_CDONE R_CS R_CSI R_Hold R_MISO R_MOSI R_WP = CRCW060310K0FKEB: Resistor; Manufacturer_Name: Vishay; Datasheet Link: http://www.vishay.com/docs/20035/dcrcwe3.pdf; Height: 0.5mm; Manufacturer_Part_Number: CRCW060310K0FKEB; Mouser Part Number: 71-CRCW060310K0FKEB; Mouser Price/Stock: https://www.mouser.co.uk/ProductDetail/Vishay-Dale/CRCW060310K0FKEB?qs=KP%252BPudsHLdyVfHu6lav4Iw%3D%3D; Arrow Part Number: CRCW060310K0FKEB; Arrow Price/Stock: https://www.arrow.com/en/products/crcw060310k0fkeb/vishay
Rk = CAT16A-1002F4LF: Resistor Network; Manufacturer_Name: Bourns; Datasheet Link: https://www.bourns.com/docs/product-datasheets/cat16a-lf.pdf?sfvrsn=f78c48f6_4; Height: 0.65mm; Manufacturer_Part_Number: CAT16A-1002F4LF; Mouser Part Number: 652-CAT16A-1002F4LF; Mouser Price/Stock: https://www.mouser.co.uk/ProductDetail/Bourns/CAT16A-1002F4LF?qs=IS%252B4QmGtzzqwI8c1abvAYA%3D%3D